# EAGLE design TPS61280x_Module (EAGLE 9.6.2)
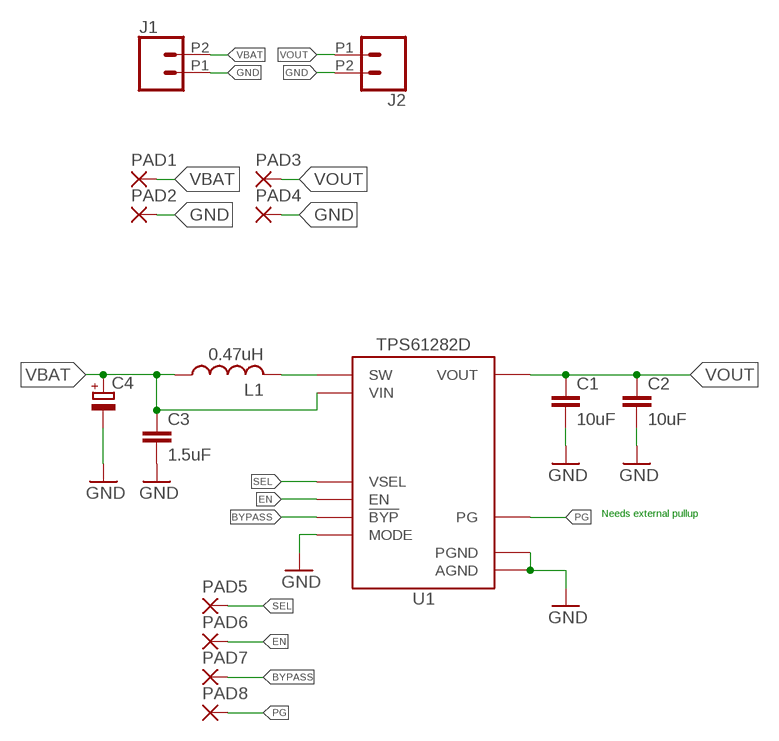
[diagram p0: schematic, sheet 1]

## Parts
C1  10uF  C-EU10UFC0805  [C0805]
C2  10uF  C-EU10UFC0805  [C0805]
C3  1.5uF  C-EU1.5UFC0805  [C0805]
C4  CTANT_EU2917  [C2917]
J1  CONN_022.54_SCREW_ROUND  [1X02_2.54_SCREWTERM_ROUND]
J2  CONN_022.54_SCREW_ROUND  [1X02_2.54_SCREWTERM_ROUND]
L1  0.47uH  INDUCTOR_MAPI_4.1X4.1  [WE-MAPI(4.1X4.1)]
PAD1  SMD5  [SMD2,54-5,08]
PAD2  SMD5  [SMD2,54-5,08]
PAD3  SMD5  [SMD2,54-5,08]
PAD4  SMD5  [SMD2,54-5,08]
PAD5  SMD2  [SMD1,27-2,54]
PAD6  SMD2  [SMD1,27-2,54]
PAD7  SMD2  [SMD1,27-2,54]
PAD8  SMD2  [SMD1,27-2,54]
U1  TPS61282D  [YFP0016]

## Nets
BYPASS: PAD7.1(P) U1.C1(!BYP)
EN: PAD6.1(P) U1.A1(EN)
GND: C1.2 C2.2 C3.2 C4.- J1.P1 J2.P2 PAD2.1(P) PAD4.1(P) U1.B2(MODE) U1.C2(AGND) U1.D1(AGND) U1.D2(PGND) U1.D3(PGND) U1.D4(PGND)
PG: PAD8.1(P) U1.A2(PG)
SEL: PAD5.1(P) U1.B1(VSEL)
SW: L1.P$2 U1.C3(SW) U1.C4(SW)
VBAT: C3.1 C4.+ J1.P2 L1.P$1 PAD1.1(P) U1.A3(VIN) U1.A4(VIN)
VOUT: C1.1 C2.1 J2.P1 PAD3.1(P) U1.B3(VOUT) U1.B4(VOUT)

## Notes on the sheet
- Needs external pullup

## Library data of the parts
C1 C2 = bschulz_passives:C-EU: CAPACITOR, European symbol; DIGIKEY: 490-6473-1-ND; MF: Murata; MPN: GRM21BR61C106KE15K
C3 = bschulz_passives:C-EU: CAPACITOR, European symbol; DIGIKEY: 399-4930-1-ND; MF: Kemet; MPN: C0805C155K4RACTU
C4 = bschulz_passives:CTANT_EU: Genaric Tantalum Capacitor
J1 J2 = bschulz:CONN_02: Genaric 2 terminal header SCREW_2.54 <https://www.digikey.com/product-detail/en/on-shore-technology-inc/OSTVN02A150/ED10561-ND/1588862> 39532_RA <https://www.digikey.com/product-detail/en/molex/0395321002/WM7845-ND/1280696>; DIGIKEY: ED10561-ND; MF: OnShore; MPN: OSTVN02A150
L1 = bschulz:INDUCTOR: Genaric Inductor
PAD1-PAD4 = wirepad:SMD5: SMD PAD
PAD5-PAD8 = bschulz:SMD2: SMD PAD; DIGIKEY: N/A; MF: N/A; MPN: DNP
U1 = bschulz:TPS6128*: TPS6128x - Low/Wide Voltage Battery Front-End DC/DC Converter, Logic Interface Characteristics: Vin: 2.3V ~ 4.8V Output Current: >4A Peak IQ: 3μA (typ), 20μA (max) Operating Temperature: -40°C to 85°C Digikey: TPS61282DYFFT <https://www.digikey.com/en/products/detail/texas-instruments/TPS61282DYFFT/9696885> TPS61281YFFT <https://www.digikey.com/en/products/detail/texas-instruments/TPS61281YFFT/4489150>; DIGIKEY: 296-50826-1-ND; DISP: TPS61282D; MF: TI; MPN: TPS61282DYFFT

## Board
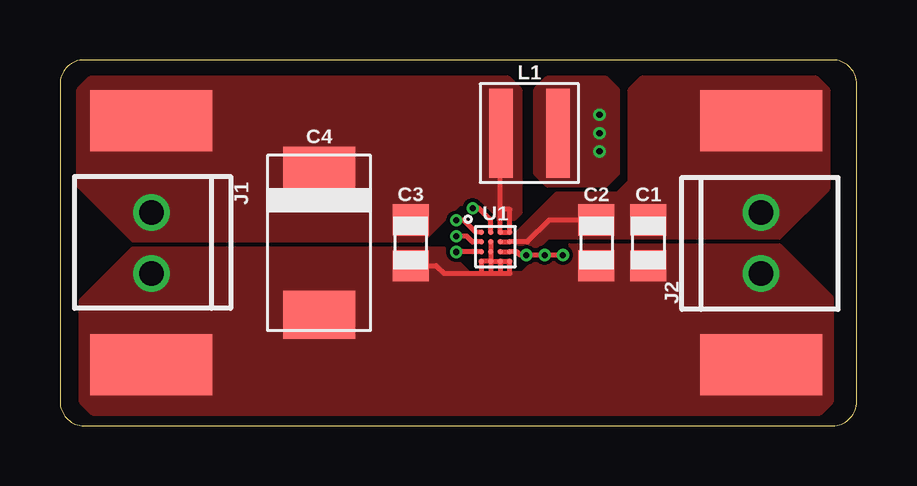
[diagram p1: board, top side]
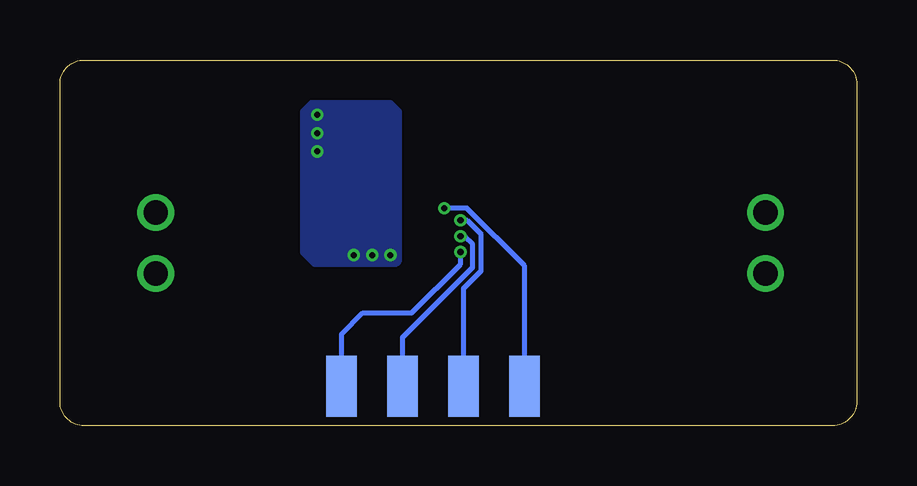
[diagram p2: board, bottom side, seen from below]

Size 33.2 x 15.24 mm. Coordinates in mm from the lower left corner, seen from the top.
Outline: 0,14.24 0,1 arc90 1,0 32.2,0 arc90 33.2,1 33.2,14.24 arc90 32.2,15.24 1,15.24 arc90 0,14.24
Copper layers (1*16): Top 0.035559375mm / dielectric 1.6mm / Bottom 0.035559375mm
Design rules "oshpark-2layer": minimum track width 6mil, minimum drill 10mil, track to track 6mil, track to pad 6mil, pad to pad 6mil, via to via 6mil, smd to smd 6mil, copper to edge 15mil, drill to drill 6mil, minimum pad ring 5mil, minimum via ring 5mil, stop-mask expansion 2.5mil, vias tented up to drill 0mil, thermal gap 10mil

### Footprints (pad centres in the part's own frame; a part is rotated, then mirrored left to right if it is on the bottom)
C0805 = smd 1.3 x 1.5: 1 -0.95,0; 2 0.95,0
C2917 = smd 2 x 3: + -3,0; - 3,0
1X02_2.54_SCREWTERM_ROUND = drill 1.016: P1 1.27,0; P2 -1.27,0
WE-MAPI(4.1X4.1) = smd 0.98 x 3.7: P$1 -1.185,0; P$2 1.185,0
SMD2,54-5,08 = smd 2.54 x 5.08: 1 0,0
SMD1,27-2,54 = smd 1.27 x 2.54: 1 0,0
YFP0016 = smd 0.23 x 0.23: A1 -0.6,0.6; A2 -0.2,0.6; A3 0.2,0.6; A4 0.6,0.6; B1 -0.6,0.2; B2 -0.2,0.2; B3 0.2,0.2; B4 0.6,0.2; C1 -0.6,-0.2; C2 -0.2,-0.2; C3 0.2,-0.2; C4 0.6,-0.2; D1 -0.6,-0.6; D2 -0.2,-0.6; D3 0.2,-0.6; D4 0.6,-0.6

### Placement (x,y rotation side)
C1  24.51,7.62 270 top
C2  22.35,7.62 270 top
C3  14.61,7.62 270 top
C4  10.79,7.62 270 top
J1  3.81,7.62 270 top
J2  29.21,7.62 90 top
L1  19.56,12.19 0 top
PAD1  3.81,12.7 90 top
PAD2  3.81,2.54 90 top
PAD3  29.21,12.7 90 top
PAD4  29.21,2.54 90 top
PAD5  18.92,1.65 0 bottom
PAD6  16.38,1.65 0 bottom
PAD7  21.46,1.65 0 bottom
PAD8  13.84,1.65 0 bottom
U1  18.14,7.46 0 top

### Tracks (layer width: path | path; a pad name or v marks a point on that pad's centre or on a via)
BYPASS  (via drill 0.25 pad 0.17)
  Top 0.2: U1.C1 16.53,7.26 v16.51,7.24
  Bottom 0.2: PAD7.1 21.46,3.81 20.57,4.7 18.54,4.7 16.51,6.73 v16.51,7.24
EN  (via drill 0.25 pad 0.17)
  Top 0.2: v16.51,8.56 16.82,8.56 17.32,8.06 U1.A1
  Bottom 0.2: PAD6.1 16.38,5.72 15.65,6.46 15.65,7.98 16.23,8.56 v16.51,8.56
GND
  Top 0.2: U1.B2 U1.C2 U1.D2 | U1.D2 U1.D3 | U1.D3 U1.D4 18.74,6.35 18.34,6.35 | U1.D2 U1.D1 17.54,6.35 | C3.2 15.68,6.67 16,6.35 17.54,6.35 | 17.54,6.35 17.94,6.35 | 17.94,6.35 18.34,6.35 | U1.D3 18.34,6.35 | U1.D2 17.94,6.35
  pour Top (no thermals): 0.89,5.21 3.05,7.37 16,7.37 17.02,6.35 19.3,6.35 20.45,7.49 29.97,7.49 32.13,5.33 32.13,1.01 31.63,0.51 1.39,0.51 0.89,1.01
PG  (via drill 0.25 pad 0.17)
  Top 0.2: U1.A2 17.94,8.56 17.44,9.06 v17.19,9.06
  Bottom 0.2: v17.19,9.06 16.85,9.06 16.85,9.07 16.24,9.07 13.84,6.67 PAD8.1
SEL  (via drill 0.25 pad 0.17)
  Top 0.2: U1.B1 17.19,7.66 16.95,7.9 v16.51,7.9
  Bottom 0.2: PAD5.1 18.92,3.68 16,6.6 16,7.58 16.33,7.9 v16.51,7.9
SW  (via drill 0.25 pad 0.17)
  Top 0.2: U1.C3 U1.C4 19.03,7.26 19.18,7.11 v19.43,7.11 v20.19,7.11 v20.95,7.11
  other vias: 22.48,11.43 22.48,12.19 22.48,12.95
  pour Top (no thermals): 20.31,10.03 22.74,10.03 23.24,10.53 23.24,13.98 22.74,14.48 20.31,14.48 19.81,13.98 19.81,10.53
  pour Bottom: 19.05,13.09 19.42,13.46 22.73,13.46 23.11,13.08 23.11,7.23 22.61,6.73 19.18,6.73 19.05,6.86
VBAT
  Top 0.2: 18.34,9.02 U1.A3 U1.A4 18.74,9.02 18.34,9.02 | 18.34,9.02 18.34,11.3 18.29,11.3 18.29,12.19 L1.P$1
  pour Top (no thermals): 0.76,10.03 3.05,7.75 15.11,7.75 16.64,9.27 17.53,9.27 18.16,8.64 18.93,8.64 19.18,8.89 19.18,13.98 18.68,14.48 1.26,14.48 0.76,13.98
VOUT
  Top 0.2: U1.B3 U1.B4 19.47,7.66 20.38,8.57 C2.1
  pour Top (no thermals): 20.7,9.65 19.05,8 19.05,7.62 19.18,7.49 19.94,7.49 20.32,7.87 29.97,7.87 32,9.91 32,13.98 31.5,14.48 24.25,14.48 23.75,13.98 23.75,10.15 23.25,9.65

### Text on the board
tDocu: VBat | Vout | + | + | -\ | -\
bDocu: Tosche / TPS6128x / v1.0 / B. Schulz | PG | EN | SEL | !BYP